# Altium project X98_CARRIER_V1R2.PrjPcb (part 3 of 3)

## Sheet 12 CONSOLE.SchDoc
size A4
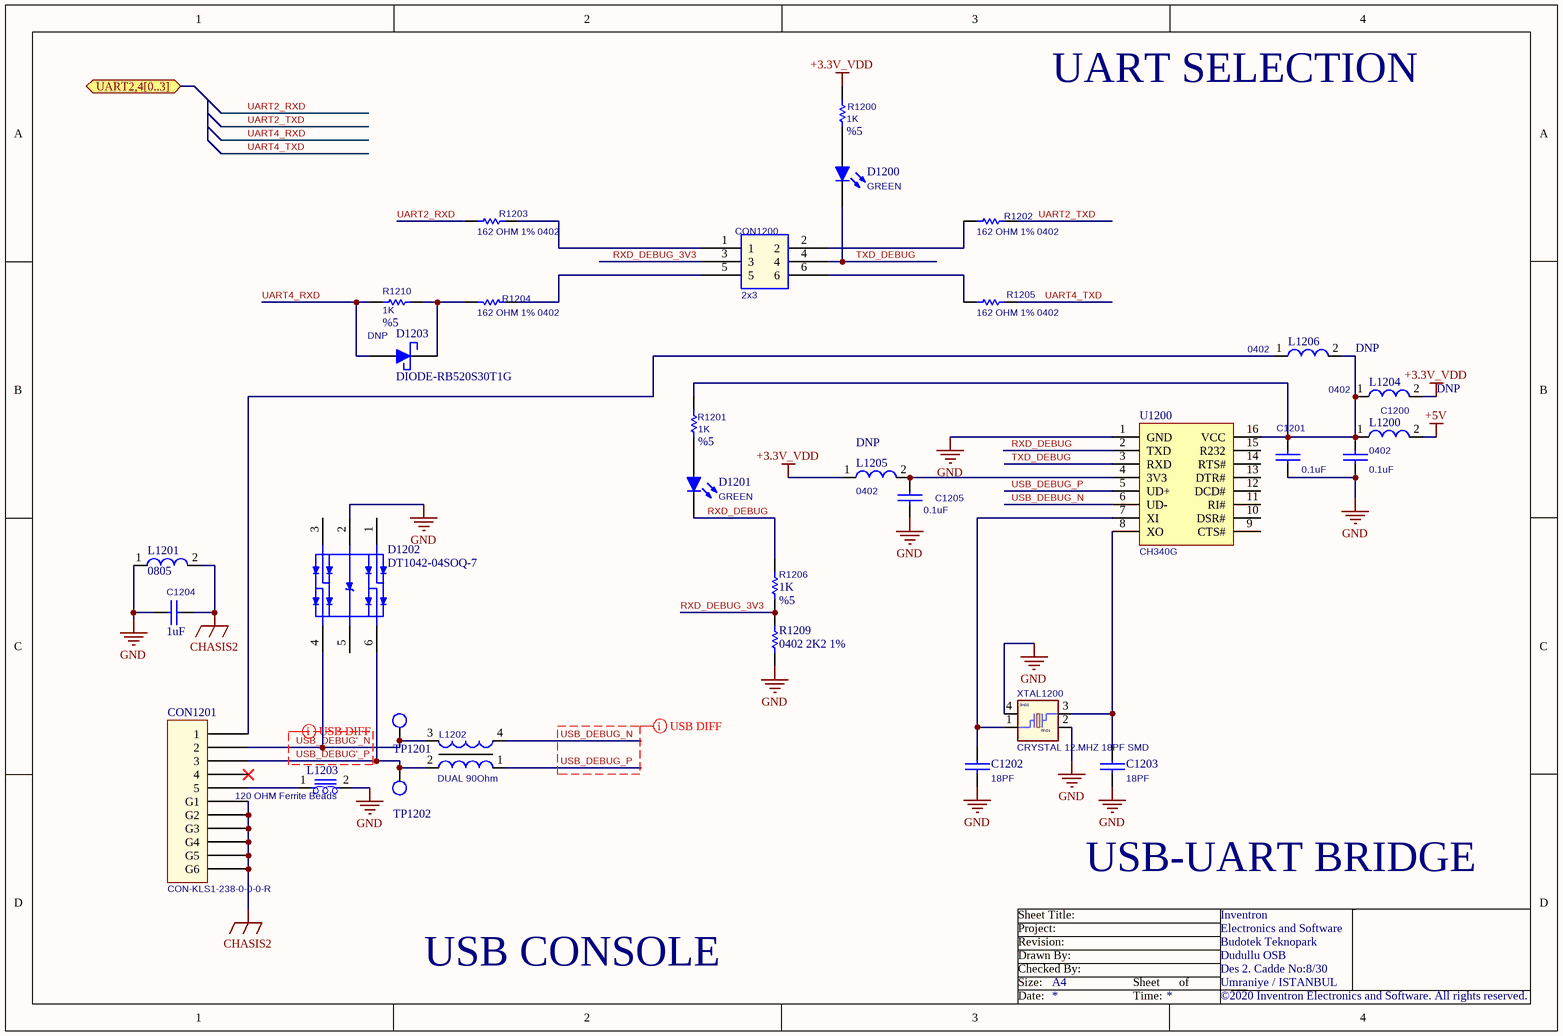
[diagram p12: 12 CONSOLE.SchDoc]

### Parts
C1200  0.1uF  [0402_CC]
C1201  0.1uF  [0402_CC]
C1202  18PF  [0402_CC]
C1203  18PF  [0402_CC]
C1204  1uF  [0603_CC]
C1205  0.1uF  [0402_CC]
CON1200  2x3  [HEADER 2.54 X 3x2]
CON1201  CON-KLS1-238-0-0-0-R  [KLS1-238-0-0-0-R]
D1200  GREEN  [0603_LED]
D1201  GREEN  [0603_LED]
D1202  DT1042-04SOQ-7  [DIODE-DT1042-04SOQ-7]
D1203  DIODE-RB520S30T1G  [SOD523]
L1200  0402  [0402_RES]
L1201  0805  [0805]
L1202  DUAL 90Ohm  [DLW21H]
L1203  120 OHM Ferrite Beads  [0603_RES]
L1204  0402  ASSY_OPT: DNP  [0402_RES]  (no BOM)
L1205  0402  ASSY_OPT: DNP  [0402_RES]  (no BOM)
L1206  0402  ASSY_OPT: DNP  [0402_RES]  (no BOM)
R1200  1K  Tolerance: %5  [0402_RES]
R1201  1K  Tolerance: %5  [0402_RES]
R1202  162 OHM 1% 0402  [0402_RES]
R1203  162 OHM 1% 0402  [0402_RES]
R1204  162 OHM 1% 0402  [0402_RES]
R1205  162 OHM 1% 0402  [0402_RES]
R1206  1K  Tolerance: %5  [0402_RES]
R1209  0402 2K2 1%  [0402_RES]
R1210  1K  ASSY_OPT: DNP  Tolerance: %5  [0402_RES]  (no BOM)
TP1201  TEST POINT 15  [testpoint_15]  (value not drawn)  (no BOM)
TP1202  TEST POINT 15  [testpoint_15]  (value not drawn)  (no BOM)
U1200  CH340G  [CH340G]
XTAL1200  CRYSTAL 12.MHZ 18PF SMD  [XTLOSC4_3P2X2P5MM_SM]

### Ports
UART2,4[0..3] (bidir)

### Nets
+3.3V_VDD: L1204.2 L1205.1 R1200.1
+5V: L1200.2
CHASIS2: C1204.1 CON1201.G1 CON1201.G2 CON1201.G3 CON1201.G4 CON1201.G5 CON1201.G6 L1201.2
GND: C1200.2 C1201.2 C1202.2 C1203.2 C1204.2 C1205.2 D1202.2(VSS) L1201.1 L1203.2 R1209.1 U1200.1(GND) XTAL1200.2(GND1) XTAL1200.4(GND2)
RXD_DEBUG: D1201.2(K) R1206.2 U1200.2(TXD)
RXD_DEBUG_3V3: CON1200.3 R1206.1 R1209.2
TXD_DEBUG: CON1200.4 D1200.2(K) U1200.3(RXD)
UART2_RXD: R1203.1
UART2_TXD: R1202.2
UART4_RXD: D1203.1(A) R1210.1
UART4_TXD: R1205.2
USB_DEBUG'_N: CON1201.2 D1202.4(IO3) L1202.3 TP1201.1
USB_DEBUG'_P: CON1201.3 D1202.6(IO4) L1202.2 TP1202.1
USB_DEBUG_N: L1202.4 U1200.6(UD-)
USB_DEBUG_P: L1202.1 U1200.5(UD+)
NetC1200_1: C1200.1 C1201.1 L1200.1 L1204.1 L1206.2 R1201.1 U1200.16(VCC)
NetC1202_1: C1202.1 U1200.7(XI) XTAL1200.1
NetC1203_1: C1203.1 U1200.8(XO) XTAL1200.3
NetC1205_1: C1205.1 L1205.2 U1200.4(3V3)
NetCON1200_1: CON1200.1 R1203.2
NetCON1200_2: CON1200.2 R1202.1
NetCON1200_5: CON1200.5 R1204.2
NetCON1200_6: CON1200.6 R1205.1
NetCON1201_1: CON1201.1 L1206.1
NetCON1201_5: CON1201.5 L1203.1
NetD1200_1: D1200.1(A) R1200.2
NetD1201_1: D1201.1(A) R1201.2
NetD1203_2: D1203.2(K) R1204.1 R1210.2

Not connected (* = marked no-connect by the designer): CON1201 4*; D1202 1(IO1) 3(IO2) 5(VCC); U1200 9(CTS#) 10(DSR#) 11(RI#) 12(DCD#) 13(DTR#) 14(RTS#) 15(R232)

### Layout directives
differential pair; differential pair class USB 90 OHM DIFF: USB_DEBUG'_N, USB_DEBUG'_P, USB_DEBUG_N, USB_DEBUG_P

### Notes on the sheet
- UART SELECTION
- USB-UART BRIDGE
- USB CONSOLE
- Sheet Title:
- Inventron
- Size:
- Drawn By:
- Revision:
- Project:
- Checked By:
- A4
- Sheet
- of
- Budotek Teknopark
- Dudullu OSB
- Des 2. Cadde No:8/30
- Umraniye / ISTANBUL
- Electronics and Software
- Date:
- Time:
- ©2020 Inventron Electronics and Software. All rights reserved.

### Library data of the parts
C1200 C1201 C1205 = CAP-CL05B104KO5NNNC: as C600-C604 on sheet 06 MIPI-DSI to HDMI; Manufacturer Part Number-1: CL05B104KO5NNNC; Footprint: 0402; Manufacturer-2: *; Manufacturer Part Number-2: *; Inventron Stock No: *; Created By: LA; Created Date: 23.11.2018; Checked By: *; ASSY_OPT: *; Dimensions: *; Unit Price: 0,00499; Revision Date/Note: *; Price Break: 10K
C1202 C1203 = CAP-GCM1555C1H180JA16D: CAP CER 18PF 50V C0G/NP0 0402; Manufacturer-1: Murata Electronics; Class: Capacitor; Manufacturer Part Number-1: GCM1555C1H180JA16D; Footprint: *; Manufacturer-2: *; Manufacturer Part Number-2: *; Inventron Stock No: *; Created By: *; Created Date: *; Checked By: *; ASSY_OPT: *; Dimensions: *; Unit Price: *; Revision Date/Note: *; Price Break: *; Opt. Temp.: *; Features: *
C1204 = CAP-CL10B105KA8NNNC: CAP CER 1UF 25V X7R 0603; Manufacturer-1: SAMSUNG; Class: Capacitor; Manufacturer Part Number-1: CL10B105KA8NNNC; Footprint: *; Manufacturer-2: *; Manufacturer Part Number-2: *; Inventron Stock No: *; Created By: LA; Created Date: *; Checked By: *; ASSY_OPT: *; Dimensions: *; Unit Price: *; Revision Date/Note: *; Price Break: *; Opt. Temp.: *; Features: *
CON1200 = CON-6 PIN 2.54MM: 2x3 6 PIN 2.54MM HEADER; Class: Connector; Manufacturer Part Number-1: *; Footprint: *; Manufacturer-1: *; Manufacturer-2: *; Manufacturer Part Number-2: *; Inventron Stock No: *; Created By: *; Created Date: *; Checked By: *; ASSY_OPT: *; Dimensions: *; Unit Price: *; Revision Date/Note: *; Price Break: *; Opt. Temp.: *
CON1201 = CON-KLS1-238-0-0-0-R: Manufacturer-1: KLS; Class: Connector; Manufacturer Part Number-1: KLS1-238-0-0-0-R; Footprint: *; Manufacturer-2: *; Manufacturer Part Number-2: *; Inventron Stock No: *; Created By: OKS,EE; Created Date: *; Checked By: *; ASSY_OPT: *; Dimensions: *; Unit Price: 0.085,0.078; Revision Date/Note: *; Price Break: 1000,5000; Opt. Temp.: *; Features: *
D1200 D1201 = LED-LTST-C190KRKT: LED SMD 0603 SUPER GREEN; Manufacturer-1: LITEON; Manufacturer Part Number-1: LTST-C190KRKT; Footprint: *; Manufacturer-2: *; Manufacturer Part Number-2: *; Inventron Stock No: *; Created By: *; Created Date: *; Checked By: *; ASSY_OPT: *; Dimensions: *; Unit Price: 0.03343; Revision Date/Note: *; Price Break: 4000; Opt. Temp.: *; Class: Led; Features: *
D1202 = DIODE-DT1042-04SOQ-7: as D601-D603 on sheet 06 MIPI-DSI to HDMI; Manufacturer Part Number-1: DT1042-04SOQ-7; Footprint: SOT26; Manufacturer-2: *; Manufacturer Part Number-2: *; Inventron Stock No: *; Created By: E.E; Created Date: 23.10.2020; Checked By: *; ASSY_OPT: *; Dimensions: *; Unit Price: 0.07575; Revision Date/Note: *; Price Break: 3000; Class: Diode
D1203 = DIODE-RB520S30T1G: DIODE SCHOTTKY 30V 200MA SOD523; Manufacturer-1: ON SEMI; Opt. Temp.: -55/+150; Manufacturer Part Number-1: RB520S30T1G; Footprint: SOD-523; Manufacturer-2: *; Manufacturer Part Number-2: *; Inventron Stock No: *; Created By: LA; Created Date: 23.11.2018; Checked By: *; ASSY_OPT: *; Dimensions: *; Unit Price: 0,0324; Revision Date/Note: *; Price Break: 3K; Class: Diode
L1200 L1204-L1206 = IND-FERRITE (RES 0 OHM) 0402: 0OHM 0402; Manufacturer Part Number-1: RMCF0402ZT0R00; Manufacturer-1: Stackpole Electronics Inc; Class: Inductor; Footprint: 0402; Manufacturer-2: *; Inventron Stock No: *; Created By: EE; Checked By: *; Dimensions: *; Unit Price: 0.00186; Revision Date/Note: *; Price Break: 1000
  L1200: ASSY_OPT: *
L1201 = IND-FERRITE (RES 0 OHM) 0805: 0OHM 0805; Manufacturer Part Number-1: AC0805JR-070RL; Manufacturer-1: YAGEO; Class: Inductor; Manufacturer-2: *; Inventron Stock No: *; Created By: EE; Checked By: *; ASSY_OPT: *; Dimensions: *; Revision Date/Note: *
L1202 = IND-DLW21HN900SQ2L: Common Mode Chokes Dual 90Ohm 100MHz 0.33A 0.35Ohm DCR SMD T/R; Manufacturer-1: Murata Manufacturing; Class: Inductor; Manufacturer Part Number-1: DLW21HN900SQ2L; Footprint: *; Manufacturer-2: *; Manufacturer Part Number-2: *; Inventron Stock No: *; Created By: E.E; Created Date: 2.11.2020; Checked By: *; ASSY_OPT: *; Dimensions: *; Unit Price: 0.185; Revision Date/Note: *; Price Break: 3000; Opt. Temp.: *; Features: *
L1203 = IND-BLM18PG121SH1D: Ferrite Beads Multi-Layer 120Ohm 25% 100MHz 2A 0.05Ohm DCR 0603 Automotive T/R; Manufacturer-1: Murata Manufacturing; Class: Inductor; Manufacturer Part Number-1: BLM18PG121SH1D; Footprint: 0603; Manufacturer-2: *; Manufacturer Part Number-2: *; Inventron Stock No: *; Created By: E.E; Created Date: 2.11.2020; Checked By: *; ASSY_OPT: *; Dimensions: *; Unit Price: 0.02550; Revision Date/Note: *; Price Break: 4000; Opt. Temp.: *; Features: *
R1200 R1201 R1206 R1210 = RES-RMCF0402JT1K00: RES 1K OHM 5% 1/16W 0402; Manufacturer-1: STACKPOLE; Opt. Temp.: -55/+155; Class: Resistor; Manufacturer Part Number-1: RMCF0402JT1K00; Footprint: 0402; Manufacturer-2: *; Manufacturer Part Number-2: *; Inventron Stock No: *; Created By: LA; Created Date: 23.11.2018; Checked By: *; Dimensions: *; Unit Price: 0,00127; Revision Date/Note: *; Price Break: 10K
  R1200 R1201 R1206: ASSY_OPT: *
R1202-R1205 = RES-ERJ-2RKF1620X: 162 ±1% 0.1W, 1/10W Chip Resistor 0402 (1005 Metric) Automotive AEC-Q200 Thick Film; Manufacturer-1: Panasonic Electronic Components; Manufacturer Part Number-1: ERJ-2RKF1620X; Footprint: 0402; Manufacturer-2: *; Manufacturer Part Number-2: *; Inventron Stock No: *; Created By: E.E; Created Date: 8.11.2020; Checked By: *; ASSY_OPT: *; Dimensions: *; Unit Price: *; Revision Date/Note: *; Price Break: *; Opt. Temp.: *; Class: Resistor; Tolerance: *
R1209 = RES-CRGCQ0402F2K2: 2.2 ±1% 0.063W, 1/16W Chip Resistor 0402 (1005 Metric) Automotive AEC-Q200, Moisture Resistant Thick Film; Manufacturer-1: TE Connectivity Passive Product; Opt. Temp.: -55°C ~ 155°C; Manufacturer Part Number-1: CRGCQ0402F2K2; Footprint: 0402; Manufacturer-2: *; Manufacturer Part Number-2: *; Inventron Stock No: *; Created By: E.E; Created Date: 22.10.2020; Checked By: *; ASSY_OPT: *; Dimensions: *; Unit Price: *; Revision Date/Note: *; Price Break: *; Class: Resistor; Tolerance: *
U1200 = IC-CH340G: IC-340 USB INTERFACE SO16; Manufacturer-1: ÖZDİSAN; Class: ICs; Manufacturer Part Number-1: CH340G; Footprint: S016; Manufacturer-2: *; Manufacturer Part Number-2: *; Inventron Stock No: *; Created By: E.E.; Created Date: 16.10.2020; Checked By: *; ASSY_OPT: *; Dimensions: *; Unit Price: 0.35; Revision Date/Note: *; Price Break: 5000; Opt. Temp.: *
XTAL1200 = XTAL-FA-238V 12.0000MB50X-C0: CRYSTAL 12.0000MHZ 18PF SMD; Manufacturer-1: EPSON; Opt. Temp.: +40/+85; Manufacturer Part Number-1: FA-238V 12.0000MB50X-C0; Footprint: 4-SMD; Manufacturer-2: *; Manufacturer Part Number-2: *; Inventron Stock No: *; Created By: E.E; Created Date: 20.10.2020; Checked By: *; ASSY_OPT: *; Dimensions: *; Unit Price: 0.6; Revision Date/Note: *; Price Break: 1K; Class: Crystal

## Sheet 13 CAN RS232 485.SchDoc
size A4

### Notes on the sheet
- Sheet Title:
- Inventron
- Size:
- Drawn By:
- Revision:
- Project:
- Checked By:
- A4
- Sheet
- of
- Budotek Teknopark
- Dudullu OSB
- Des 2. Cadde No:8/30
- Umraniye / ISTANBUL
- Electronics and Software
- Date:
- Time:
- ©2020 Inventron Electronics and Software. All rights reserved.

## Sheet 00 PCB SPEC.SchDoc
size A2
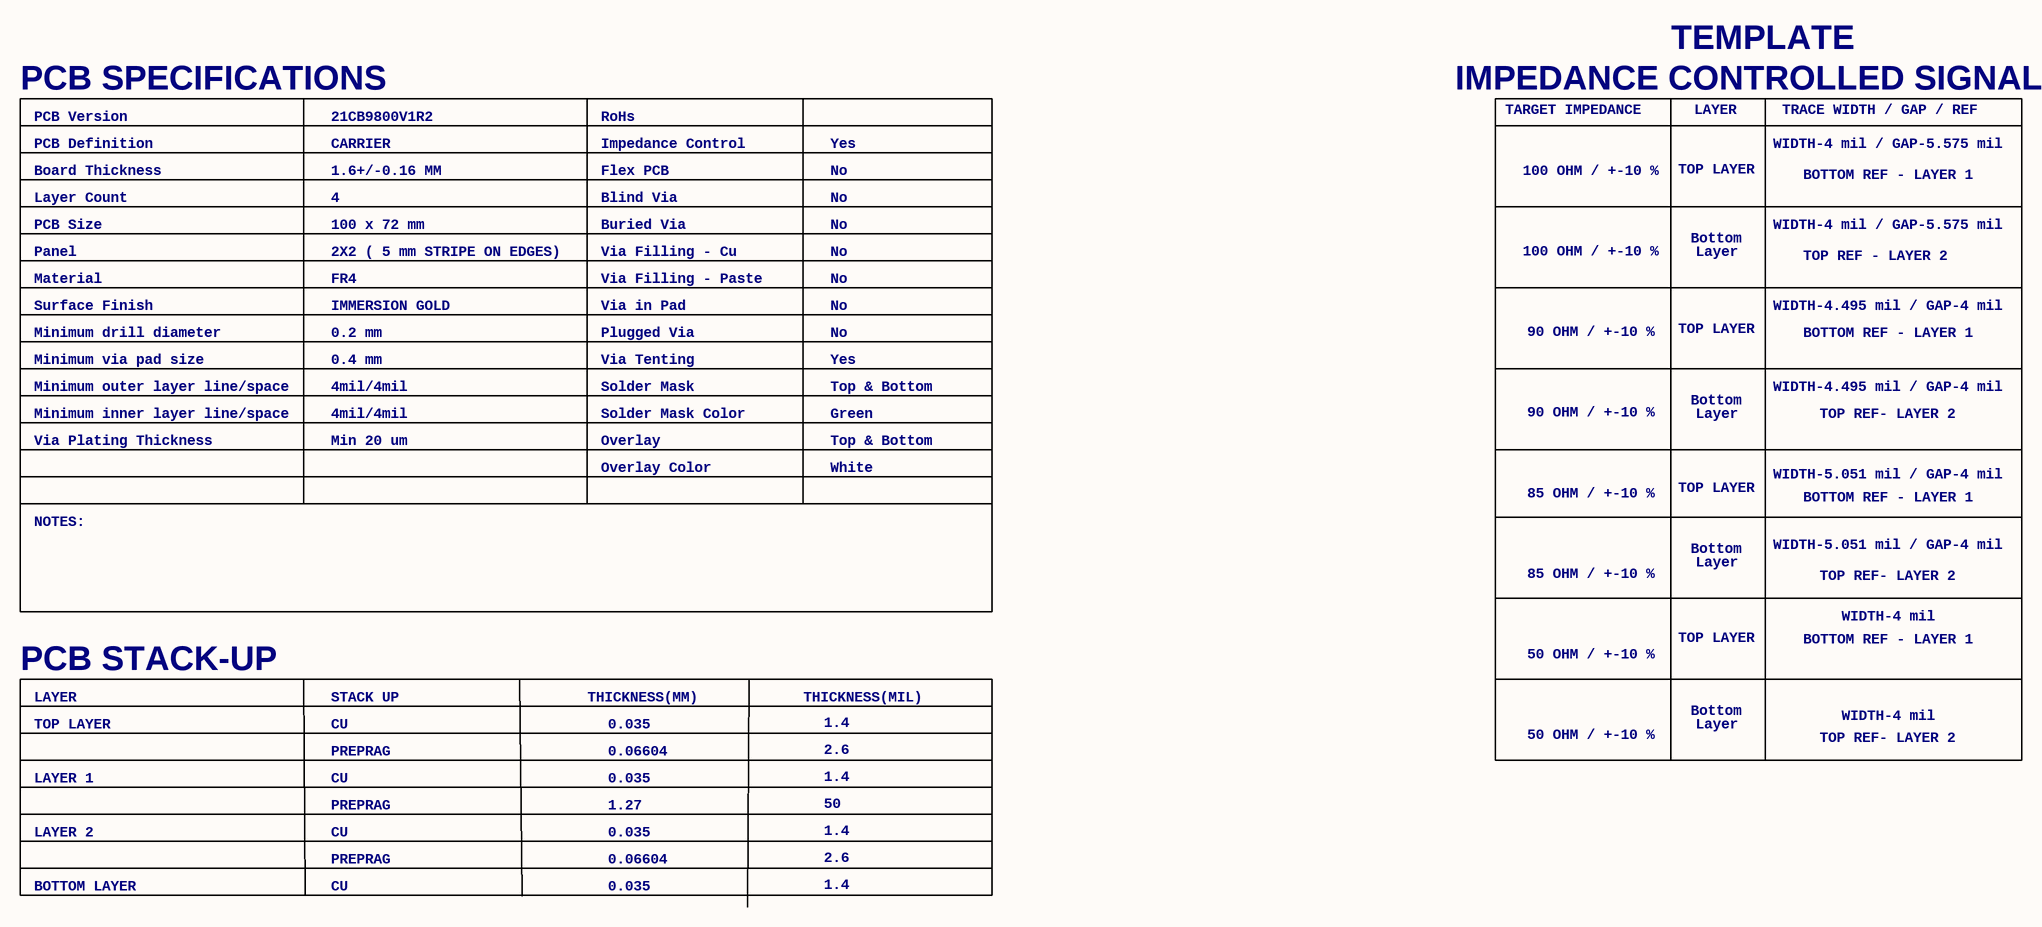
[diagram p13: 00 PCB SPEC.SchDoc]

### Notes on the sheet
- TEMPLATE
- PCB SPECIFICATIONS
- PCB Version
- 21CB9800V1R2
- RoHs
- IMPEDANCE CONTROLLED SIGNALS
- TARGET IMPEDANCE
- LAYER
- TRACE WIDTH / GAP / REF
- Board Thickness
- Layer Count
- PCB Definition
- 1.6+/-0.16 MM
- 4
- CARRIER
- Impedance Control
- Flex PCB
- Blind Via
- Yes
- No
- 100 OHM / +-10 %
- TOP LAYER
- WIDTH-4 mil / GAP-5.575 mil
- BOTTOM REF - LAYER 1
- PCB Size
- Panel
- 100 x 72 mm
- 2X2 ( 5 mm STRIPE ON EDGES)
- Buried Via
- Via Filling - Cu
- Bottom
- Layer
- TOP REF - LAYER 2
- Material
- Minimum drill diameter
- Surface Finish
- FR4
- IMMERSION GOLD
- 0.2 mm
- Via Filling - Paste
- Via in Pad
- Plugged Via
- 90 OHM / +-10 %
- WIDTH-4.495 mil / GAP-4 mil
- Minimum via pad size
- Minimum outer layer line/space
- 0.4 mm
- 4mil/4mil
- Via Tenting
- Solder Mask
- Top & Bottom
- Minimum inner layer line/space
- Via Plating Thickness
- Min 20 um
- Solder Mask Color
- Overlay
- Overlay Color
- Green
- White
- WIDTH-5.051 mil / GAP-4 mil
- TOP REF- LAYER 2
- NOTES:
- 85 OHM / +-10 %
- PCB STACK-UP
- 50 OHM / +-10 %
- WIDTH-4 mil
- STACK UP
- CU
- THICKNESS(MM)
- 0.035
- THICKNESS(MIL)
- 1.4
- LAYER 1
- PREPRAG
- 0.06604
- 1.27
- 2.6
- 50
- LAYER 2
- BOTTOM LAYER
- Sheet Title:
- Project:
- Inventron
- Electronics and Software
- Size:
- Date:
- Drawn By:
- Revision:
- Checked By:
- A4
- Sheet
- Time:
- of
- Budotek Teknopark
- Dudullu OSB
- Des 2. Cadde No:8/30
- ©2020 Inventron Electronics and Software. All rights reserved.
- Umraniye / ISTANBUL

## Nets that join several sheets
+1.8V_VDD: 01 SoM IO INTERFACE (12 pins), 10 BOOT (R1031.1 R1032.1), 06 MIPI-DSI to HDMI (14 pins)
+3.3V_EXT: 07 MIPI CSI (L701.2), 08 USB OTG & POWER (L805.2 TP808.1), 06 MIPI-DSI to HDMI (L607.1)
+3.3V_VDD: 01 SoM IO INTERFACE (17 pins), 10 BOOT (17 pins), 05 MICROSD (C500.1 Q500.2 R500.2), 06 MIPI-DSI to HDMI (6 pins), 12 CONSOLE (L1204.2 L1205.1 R1200.1)
+5V: 01 SoM IO INTERFACE (11 pins), 09 USB HUB (F901.1 L909.2 R910.2), 08 USB OTG & POWER (5 pins), 06 MIPI-DSI to HDMI (7 pins), 12 CONSOLE (L1200.2)
+VBACKUP: 01 SoM IO INTERFACE (CON101.36 TP114.1), 08 USB OTG & POWER (CON801.1 D804.K R806.1)
CHASIS: 09 USB HUB (CON901.G1 CON901.G2 CON901.G3 CON901.G4), 08 USB OTG & POWER (CON803.S1 CON803.S2 CON803.S3 CON803.S4), 06 MIPI-DSI to HDMI (CON602.G1 CON602.G2 CON602.G3 CON602.G4)
GND: 01 SoM IO INTERFACE (62 pins), 07 MIPI CSI (10 pins), 09 USB HUB (37 pins), 04 PCIe (L400.2 L405.2), 08 USB OTG & POWER (19 pins), 10 BOOT (24 pins), 05 MICROSD (9 pins), 06 MIPI-DSI to HDMI (56 pins), 12 CONSOLE (13 pins)
+3.3V_EXT_ENABLE: 01 SoM IO INTERFACE (R112.2), 08 USB OTG & POWER (R813.1)
DISP_CON_O1: 01 SoM IO INTERFACE (R113.1), 06 MIPI-DSI to HDMI (CON600.18)
DISP_CON_O2: 01 SoM IO INTERFACE (R116.1), 06 MIPI-DSI to HDMI (CON600.19)
DSI/LVDS_CON_INT: 01 SoM IO INTERFACE (CON100.72), 06 MIPI-DSI to HDMI (Q600.3)
DSI_GPIO: 01 SoM IO INTERFACE (CON100.94), 06 MIPI-DSI to HDMI (R604.1)
HDMI_HPD: 01 SoM IO INTERFACE (CON100.48), 06 MIPI-DSI to HDMI (Q601.2 R627.2 TP603.1 U600.14)
I2C2_SCL_3V3: 01 SoM IO INTERFACE (CON100.22 R100.1 TP100.1), 07 MIPI CSI (R702.2), 06 MIPI-DSI to HDMI (Q602.3 R628.1)
I2C2_SDA_3V3: 01 SoM IO INTERFACE (CON100.24 R102.1 TP101.1), 07 MIPI CSI (R704.2), 06 MIPI-DSI to HDMI (Q602.6 R626.1)
I2C3_SCL_3V3: 01 SoM IO INTERFACE (CON100.30 R103.1 TP102.1), 06 MIPI-DSI to HDMI (CON600.22 Q603.1 R630.1)
I2C3_SDA_3V3: 01 SoM IO INTERFACE (CON100.34 R104.1 TP103.1), 06 MIPI-DSI to HDMI (CON600.23 Q603.4 R634.1)
I2C4_SCL_3V3: 01 SoM IO INTERFACE (CON100.26 R105.1 TP104.1), 07 MIPI CSI (R703.2)
I2C4_SDA_3V3: 01 SoM IO INTERFACE (CON100.28 R106.1 TP105.1), 07 MIPI CSI (R705.2)
IRQ_HDMI: 01 SoM IO INTERFACE (CON101.39), 06 MIPI-DSI to HDMI (U600.63)
MIPI_CSI_CLK_N: 01 SoM IO INTERFACE (CON100.53), 07 MIPI CSI (CON700.5 TP702.1)
MIPI_CSI_CLK_P: 01 SoM IO INTERFACE (CON100.51), 07 MIPI CSI (CON700.6 TP703.1)
MIPI_CSI_D0_N: 01 SoM IO INTERFACE (CON100.59), 07 MIPI CSI (CON700.2 TP700.1)
MIPI_CSI_D0_P: 01 SoM IO INTERFACE (CON100.57), 07 MIPI CSI (CON700.3 TP701.1)
MIPI_CSI_D1_N: 01 SoM IO INTERFACE (CON100.47), 07 MIPI CSI (CON700.8)
MIPI_CSI_D1_P: 01 SoM IO INTERFACE (CON100.45), 07 MIPI CSI (CON700.9)
MIPI_CSI_D2_N: 01 SoM IO INTERFACE (CON100.41), 07 MIPI CSI (CON700.11)
MIPI_CSI_D2_P: 01 SoM IO INTERFACE (CON100.39), 07 MIPI CSI (CON700.12)
MIPI_CSI_D3_N: 01 SoM IO INTERFACE (CON100.35), 07 MIPI CSI (CON700.14)
MIPI_CSI_D3_P: 01 SoM IO INTERFACE (CON100.33), 07 MIPI CSI (CON700.15)
MIPI_DSI_CK_N: 01 SoM IO INTERFACE (CON100.15), 06 MIPI-DSI to HDMI (R641.1 U600.8)
MIPI_DSI_CK_P: 01 SoM IO INTERFACE (CON100.17), 06 MIPI-DSI to HDMI (R639.1 U600.7)
MIPI_DSI_D0_N: 01 SoM IO INTERFACE (CON100.27), 06 MIPI-DSI to HDMI (R607.1 U600.2)
MIPI_DSI_D0_P: 01 SoM IO INTERFACE (CON100.29), 06 MIPI-DSI to HDMI (R605.1 U600.1)
MIPI_DSI_D1_N: 01 SoM IO INTERFACE (CON100.21), 06 MIPI-DSI to HDMI (R637.1 U600.4)
MIPI_DSI_D1_P: 01 SoM IO INTERFACE (CON100.23), 06 MIPI-DSI to HDMI (R635.1 U600.3)
MIPI_DSI_D2_N: 01 SoM IO INTERFACE (CON100.9), 06 MIPI-DSI to HDMI (R645.1 U600.10)
MIPI_DSI_D2_P: 01 SoM IO INTERFACE (CON100.11), 06 MIPI-DSI to HDMI (R643.1 U600.9)
MIPI_DSI_D3_N: 01 SoM IO INTERFACE (CON100.3), 06 MIPI-DSI to HDMI (R649.1 U600.12)
MIPI_DSI_D3_P: 01 SoM IO INTERFACE (CON100.5), 06 MIPI-DSI to HDMI (R647.1 U600.11)
nRESET_HDMI: 01 SoM IO INTERFACE (CON101.41), 06 MIPI-DSI to HDMI (C640.1 R632.1 U600.64)
ONOFF: 01 SoM IO INTERFACE (CON100.46), 10 BOOT (CON1001.1 SW1001.2 TP1001.1)
PWDN_CAM_C: 01 SoM IO INTERFACE (R114.2), 07 MIPI CSI (CON700.17)
PWM1_E: 01 SoM IO INTERFACE (CON100.62), 06 MIPI-DSI to HDMI (CON600.20)
PWM3_E: 01 SoM IO INTERFACE (CON100.66), 07 MIPI CSI (R701.2)
RST_CAM_C: 01 SoM IO INTERFACE (R111.2), 07 MIPI CSI (CON700.23)
SAI1_RXD0: 01 SoM IO INTERFACE (CON101.81), 10 BOOT (R1000.1 R1003.2)
SAI1_RXD1: 01 SoM IO INTERFACE (CON101.49 R111.1), 10 BOOT (R1001.1 R1004.2)
SAI1_RXD2: 01 SoM IO INTERFACE (CON101.51 R112.1), 10 BOOT (R1006.1 R1009.2)
SAI1_RXD3: 01 SoM IO INTERFACE (CON101.53 R114.1), 10 BOOT (R1007.1 R1010.2)
SAI1_RXD4: 01 SoM IO INTERFACE (CON101.55), 10 BOOT (R1014.1 R1034.1 R1038.2)
SAI1_RXD5: 01 SoM IO INTERFACE (CON101.57), 10 BOOT (R1019.1 R1036.1 R1040.2)
SAI1_RXD6: 01 SoM IO INTERFACE (CON101.61 R116.2), 10 BOOT (R1008.1 R1011.2)
SAI1_RXD7: 01 SoM IO INTERFACE (CON101.63), 10 BOOT (R1015.1 R1020.2)
SAI1_TXD0: 01 SoM IO INTERFACE (CON101.89), 10 BOOT (R1016.1 R1021.2)
SAI1_TXD1: 01 SoM IO INTERFACE (CON101.65 R113.2), 10 BOOT (R1002.1 R1005.2)
SAI1_TXD2: 01 SoM IO INTERFACE (CON101.67), 10 BOOT (R1013.1 R1033.1 R1037.2)
SAI1_TXD3: 01 SoM IO INTERFACE (CON101.69), 10 BOOT (R1023.1 R1041.1 R1043.2)
SAI1_TXD4: 01 SoM IO INTERFACE (CON101.73), 10 BOOT (R1012.1 R1035.1 R1039.2)
SAI1_TXD5: 01 SoM IO INTERFACE (CON101.75), 10 BOOT (R1024.1 R1042.1 R1044.2)
SAI1_TXD6: 01 SoM IO INTERFACE (CON101.77), 10 BOOT (R1017.1 R1022.2)
SAI1_TXD7: 01 SoM IO INTERFACE (CON101.79), 10 BOOT (R1026.1 R1029.2)
SAI2_TXC: 01 SoM IO INTERFACE (CON101.42), 06 MIPI-DSI to HDMI (U600.60)
SAI2_TXD: 01 SoM IO INTERFACE (CON101.46), 06 MIPI-DSI to HDMI (U600.58)
SAI2_TXFS: 01 SoM IO INTERFACE (CON101.44), 06 MIPI-DSI to HDMI (U600.59)
SD2_CD_B: 01 SoM IO INTERFACE (CON100.76), 05 MICROSD (R507.1)
SD2_CLK: 01 SoM IO INTERFACE (CON100.82), 05 MICROSD (R510.1)
SD2_CMD: 01 SoM IO INTERFACE (CON100.84), 05 MICROSD (R511.1)
SD2_DATA0: 01 SoM IO INTERFACE (CON100.78), 05 MICROSD (R509.1)
SD2_DATA1: 01 SoM IO INTERFACE (CON100.74), 05 MICROSD (R508.1)
SD2_DATA2: 01 SoM IO INTERFACE (CON100.88), 05 MICROSD (R513.1)
SD2_DATA3: 01 SoM IO INTERFACE (CON100.86), 05 MICROSD (R512.1)
SD2_nRST: 01 SoM IO INTERFACE (CON100.90), 05 MICROSD (Q500.1 R500.1)
SYS_BOOT_MODE0: 01 SoM IO INTERFACE (CON101.45), 10 BOOT (CON1000.5 R1028.2)
SYS_BOOT_MODE1: 01 SoM IO INTERFACE (CON101.43), 10 BOOT (CON1000.7 R1027.2)
SYS_nRST: 01 SoM IO INTERFACE (CON101.33), 10 BOOT (SW1000.3 SW1000.4 TP1000.1)
UART2_RXD: 01 SoM IO INTERFACE (CON101.94), 12 CONSOLE (R1203.1)
UART2_TXD: 01 SoM IO INTERFACE (CON101.96), 12 CONSOLE (R1202.2)
UART4_RXD: 01 SoM IO INTERFACE (CON101.92), 12 CONSOLE (D1203.1 R1210.1)
UART4_TXD: 01 SoM IO INTERFACE (CON101.88), 12 CONSOLE (R1205.2)
USB2_UP_N: 01 SoM IO INTERFACE (CON100.93), 09 USB HUB (U901.30)
USB2_UP_P: 01 SoM IO INTERFACE (CON100.95), 09 USB HUB (U901.31)